# Altium schematic sheet XTXBoard.SchDoc
size C; DocumentNumber: 6; SheetNumber: 6; SheetTotal: 8
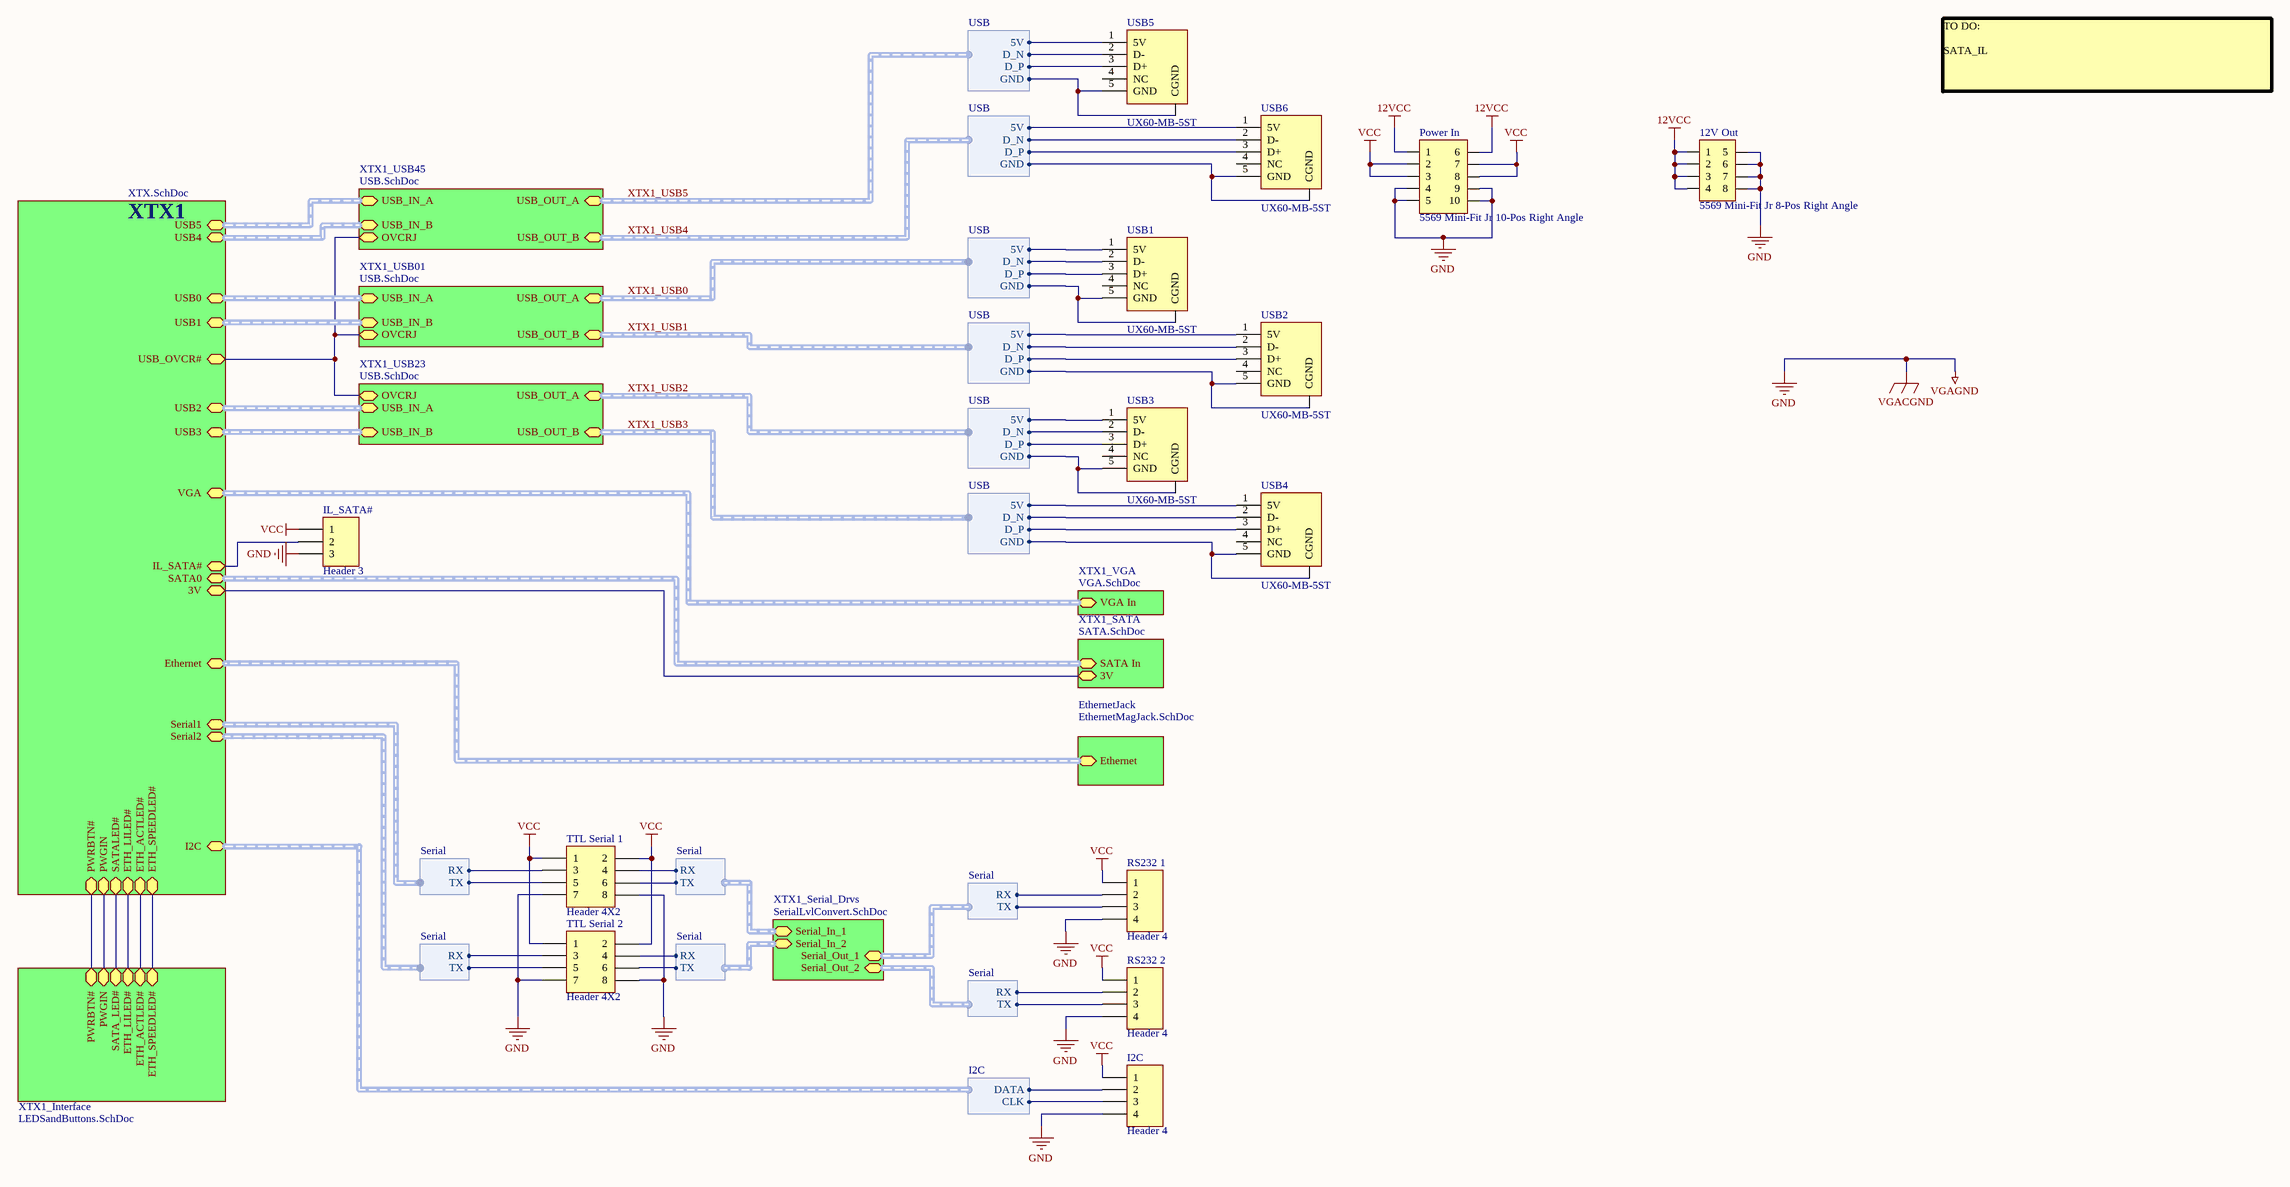
[diagram p0: XTXBoard.SchDoc]

## Parts
12V_Out  5569 Mini-Fit Jr 8-Pos Right Angle  [8-POS 5569 Mini-Fit Jr 2]
I2C  Header 4  [HDR1X4]
IL_SATA#  Header 3  [HDR1X3]
Power_In  5569 Mini-Fit Jr 10-Pos Right Angle  [10-Pos 5569 Mini-Fit Jr 2]
RS232_1  Header 4  [HDR1X4]
RS232_2  Header 4  [HDR1X4]
TTL_Serial_1  Header 4X2  [HDR2X4]
TTL_Serial_2  Header 4X2  [HDR2X4]
USB1  UX60-MB-5ST  [UX60-MB-5ST]
USB2  UX60-MB-5ST  [UX60-MB-5ST]
USB3  UX60-MB-5ST  [UX60-MB-5ST]
USB4  UX60-MB-5ST  [UX60-MB-5ST]
USB5  UX60-MB-5ST  [UX60-MB-5ST]
USB6  UX60-MB-5ST  [UX60-MB-5ST]

## Sub-sheets
EthernetJack = EthernetMagJack.SchDoc: Ethernet (harness Ethernet)
XTX1 = XTX.SchDoc: ETH_LILED#, ETH_ACTLED#, ETH_SPEEDLED#, Ethernet (harness Ethernet), SATA0 (harness SATA), VGA (harness VGA), USB0 (harness USB), USB2 (harness USB), USB3 (harness USB), USB1 (harness USB), USB_OVCR#, SATALED#, I2C (harness I2C), Serial1 (harness Serial), Serial2 (harness Serial), PWRBTN#, PWGIN, 3V, IL_SATA#, USB5 (harness USB), USB4 (harness USB)
XTX1_Interface = LEDSandButtons.SchDoc: ETH_LILED#, ETH_ACTLED#, SATA_LED#, PWRBTN#, ETH_SPEEDLED#, PWGIN
XTX1_SATA = SATA.SchDoc: SATA In (harness SATA), 3V
XTX1_Serial_Drvs = SerialLvlConvert.SchDoc: Serial_In_2 (harness Serial), Serial_In_1 (harness Serial), Serial_Out_2 (harness Serial), Serial_Out_1 (harness Serial)
XTX1_USB01 = USB.SchDoc: USB_OUT_B (harness USB), USB_IN_B (harness USB), USB_IN_A (harness USB), USB_OUT_A (harness USB), OVCRJ
XTX1_USB23 = USB.SchDoc: USB_IN_A (harness USB), USB_OUT_A (harness USB), USB_IN_B (harness USB), USB_OUT_B (harness USB), OVCRJ
XTX1_USB45 = USB.SchDoc: USB_OUT_B (harness USB), USB_IN_B (harness USB), USB_IN_A (harness USB), USB_OUT_A (harness USB), OVCRJ
XTX1_VGA = VGA.SchDoc: VGA In (harness VGA)

## Harnesses
USB: 5V, D_N, D_P, GND
I2C: CLK, DATA
Serial: RX, TX

## Nets
12VCC: 12V_Out.1 12V_Out.2 12V_Out.3 12V_Out.4 Power_In.1 Power_In.6
GND: 12V_Out.5 12V_Out.6 12V_Out.7 12V_Out.8 I2C.4 IL_SATA#.3 Power_In.4 Power_In.5 Power_In.9 Power_In.10 RS232_1.4 RS232_2.4 TTL_Serial_1.7 TTL_Serial_1.8 TTL_Serial_2.7 TTL_Serial_2.8  [also labelled VGACGND, VGAGND]
VCC: I2C.1 IL_SATA#.1 Power_In.2 Power_In.3 Power_In.7 Power_In.8 RS232_1.1 RS232_2.1 TTL_Serial_1.1 TTL_Serial_1.2 TTL_Serial_2.1 TTL_Serial_2.2
XTX1_USB0.5V: USB1.1(5V) ; sheet XTX1_USB01/USB_OUT_A.5V
XTX1_USB0.D_N: USB1.2(D-) ; sheet XTX1_USB01/USB_OUT_A.D_N
XTX1_USB0.D_P: USB1.3(D+) ; sheet XTX1_USB01/USB_OUT_A.D_P
XTX1_USB0.GND: USB1.5(GND) USB1.CGND ; sheet XTX1_USB01/USB_OUT_A.GND
XTX1_USB1.5V: USB2.1(5V) ; sheet XTX1_USB01/USB_OUT_B.5V
XTX1_USB1.D_N: USB2.2(D-) ; sheet XTX1_USB01/USB_OUT_B.D_N
XTX1_USB1.D_P: USB2.3(D+) ; sheet XTX1_USB01/USB_OUT_B.D_P
XTX1_USB1.GND: USB2.5(GND) USB2.CGND ; sheet XTX1_USB01/USB_OUT_B.GND
XTX1_USB2.5V: USB3.1(5V) ; sheet XTX1_USB23/USB_OUT_A.5V
XTX1_USB2.D_N: USB3.2(D-) ; sheet XTX1_USB23/USB_OUT_A.D_N
XTX1_USB2.D_P: USB3.3(D+) ; sheet XTX1_USB23/USB_OUT_A.D_P
XTX1_USB2.GND: USB3.5(GND) USB3.CGND ; sheet XTX1_USB23/USB_OUT_A.GND
XTX1_USB3.5V: USB4.1(5V) ; sheet XTX1_USB23/USB_OUT_B.5V
XTX1_USB3.D_N: USB4.2(D-) ; sheet XTX1_USB23/USB_OUT_B.D_N
XTX1_USB3.D_P: USB4.3(D+) ; sheet XTX1_USB23/USB_OUT_B.D_P
XTX1_USB3.GND: USB4.5(GND) USB4.CGND ; sheet XTX1_USB23/USB_OUT_B.GND
XTX1_USB4.5V: USB6.1(5V) ; sheet XTX1_USB45/USB_OUT_B.5V
XTX1_USB4.D_N: USB6.2(D-) ; sheet XTX1_USB45/USB_OUT_B.D_N
XTX1_USB4.D_P: USB6.3(D+) ; sheet XTX1_USB45/USB_OUT_B.D_P
XTX1_USB4.GND: USB6.5(GND) USB6.CGND ; sheet XTX1_USB45/USB_OUT_B.GND
XTX1_USB5.5V: USB5.1(5V) ; sheet XTX1_USB45/USB_OUT_A.5V
XTX1_USB5.D_N: USB5.2(D-) ; sheet XTX1_USB45/USB_OUT_A.D_N
XTX1_USB5.D_P: USB5.3(D+) ; sheet XTX1_USB45/USB_OUT_A.D_P
XTX1_USB5.GND: USB5.5(GND) USB5.CGND ; sheet XTX1_USB45/USB_OUT_A.GND
NetI2C_2: I2C.2 ; sheet XTX1/I2C.DATA
NetI2C_3: I2C.3 ; sheet XTX1/I2C.CLK
NetIL_SATA#_2: IL_SATA#.2 ; sheet XTX1/IL_SATA#
NetRS232_1_2: RS232_1.2 ; sheet XTX1_Serial_Drvs/Serial_Out_1.RX
NetRS232_1_3: RS232_1.3 ; sheet XTX1_Serial_Drvs/Serial_Out_1.TX
NetRS232_2_2: RS232_2.2 ; sheet XTX1_Serial_Drvs/Serial_Out_2.RX
NetRS232_2_3: RS232_2.3 ; sheet XTX1_Serial_Drvs/Serial_Out_2.TX
NetTTL_Serial_1_3: TTL_Serial_1.3 ; sheet XTX1/Serial1.RX
NetTTL_Serial_1_4: TTL_Serial_1.4 ; sheet XTX1_Serial_Drvs/Serial_In_1.RX
NetTTL_Serial_1_5: TTL_Serial_1.5 ; sheet XTX1/Serial1.TX
NetTTL_Serial_1_6: TTL_Serial_1.6 ; sheet XTX1_Serial_Drvs/Serial_In_1.TX
NetTTL_Serial_2_3: TTL_Serial_2.3 ; sheet XTX1/Serial2.RX
NetTTL_Serial_2_4: TTL_Serial_2.4 ; sheet XTX1_Serial_Drvs/Serial_In_2.RX
NetTTL_Serial_2_5: TTL_Serial_2.5 ; sheet XTX1/Serial2.TX
NetTTL_Serial_2_6: TTL_Serial_2.6 ; sheet XTX1_Serial_Drvs/Serial_In_2.TX
(unnamed): sheet XTX1/ETH_LILED#, sheet XTX1_Interface/ETH_LILED#
(unnamed): sheet XTX1/ETH_ACTLED#, sheet XTX1_Interface/ETH_ACTLED#
(unnamed): sheet XTX1/ETH_SPEEDLED#, sheet XTX1_Interface/ETH_SPEEDLED#
(unnamed): sheet XTX1/USB_OVCR#, sheet XTX1_USB01/OVCRJ, sheet XTX1_USB23/OVCRJ, sheet XTX1_USB45/OVCRJ
(unnamed): sheet XTX1/SATALED#, sheet XTX1_Interface/SATA_LED#
(unnamed): sheet XTX1/PWRBTN#, sheet XTX1_Interface/PWRBTN#
(unnamed): sheet XTX1/PWGIN, sheet XTX1_Interface/PWGIN
(unnamed): sheet XTX1/3V, sheet XTX1_SATA/3V

Not connected (* = marked no-connect by the designer): USB1 4(NC); USB2 4(NC); USB3 4(NC); USB4 4(NC); USB5 4(NC); USB6 4(NC)

## Buses and harness runs
harness sheet EthernetJack/Ethernet = sheet XTX1/Ethernet
harness sheet XTX1/SATA0 = sheet XTX1_SATA/SATA In
harness sheet XTX1/USB0 = sheet XTX1_USB01/USB_IN_A
harness sheet XTX1/USB1 = sheet XTX1_USB01/USB_IN_B
harness sheet XTX1/USB2 = sheet XTX1_USB23/USB_IN_A
harness sheet XTX1/USB3 = sheet XTX1_USB23/USB_IN_B
harness sheet XTX1/USB4 = sheet XTX1_USB45/USB_IN_B
harness sheet XTX1/USB5 = sheet XTX1_USB45/USB_IN_A
harness sheet XTX1/VGA = sheet XTX1_VGA/VGA In
harness XTX1_USB0 = sheet XTX1_USB01/USB_OUT_A
harness XTX1_USB1 = sheet XTX1_USB01/USB_OUT_B
harness XTX1_USB2 = sheet XTX1_USB23/USB_OUT_A
harness XTX1_USB3 = sheet XTX1_USB23/USB_OUT_B
harness XTX1_USB4 = sheet XTX1_USB45/USB_OUT_B
harness XTX1_USB5 = sheet XTX1_USB45/USB_OUT_A

## Notes on the sheet
- TO DO:
  SATA_IL

## Library data of the parts
I2C RS232_1 RS232_2 = Header 4: Header, 4-Pin; LatestRevisionDate: 17-Jul-2002; LatestRevisionNote: Re-released for DXP Platform.; Publisher: Altium Limited
IL_SATA# = Header 3: Header, 3-Pin; LatestRevisionDate: 17-Jul-2002; LatestRevisionNote: Re-released for DXP Platform.; Publisher: Altium Limited
TTL_Serial_1 TTL_Serial_2 = Header 4X2: Header, 4-Pin, Dual row; LatestRevisionDate: 17-Jul-2002; LatestRevisionNote: Re-released for DXP Platform.; Publisher: Altium Limited
USB1-USB6 = UX60-MB-5ST: miniUSB Type B SMT Connector